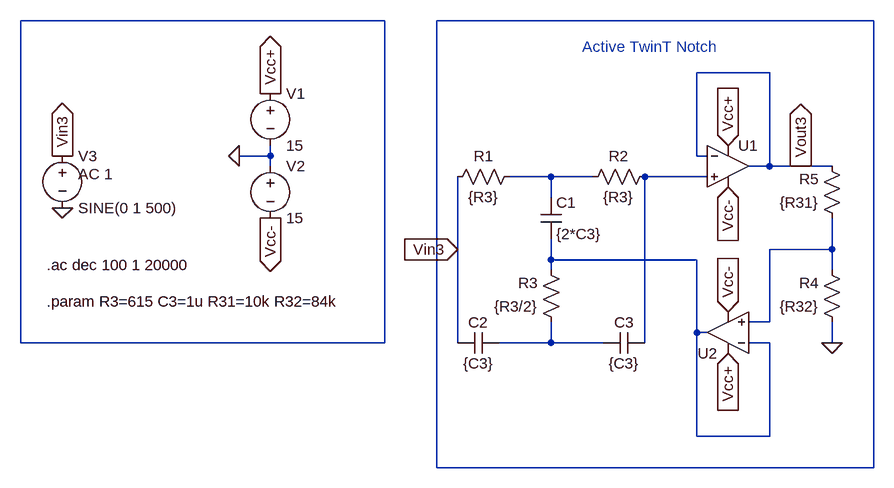
[diagram p0: schematic Twin_T_active.asc]
Twin_T_active.asc, the LTspice schematic file:
Version 4
SHEET 1 988 680
WIRE -128 -224 -688 -224
WIRE 624 -224 -48 -224
WIRE 464 -144 352 -144
WIRE -304 -16 -304 -32
WIRE -304 -16 -352 -16
WIRE 352 -16 352 -144
WIRE 368 -16 352 -16
WIRE -304 0 -304 -16
WIRE 464 0 464 -144
WIRE 464 0 432 0
WIRE 512 0 464 0
WIRE 560 0 512 0
WIRE 128 16 64 16
WIRE 192 16 128 16
WIRE 368 16 272 16
WIRE 128 48 128 16
WIRE -16 128 -16 16
WIRE 560 128 560 80
WIRE 560 128 464 128
WIRE 128 144 128 112
WIRE 352 144 128 144
WIRE 128 160 128 144
WIRE 560 160 560 128
WIRE 464 240 464 128
WIRE 464 240 432 240
WIRE 352 256 352 144
WIRE 368 256 352 256
WIRE -688 272 -688 -224
WIRE -128 272 -128 -224
WIRE -128 272 -688 272
WIRE -16 272 -16 128
WIRE 128 272 128 240
WIRE 128 272 48 272
WIRE 208 272 128 272
WIRE 272 272 272 16
WIRE 464 272 432 272
WIRE 560 272 560 240
WIRE 352 416 352 256
WIRE 464 416 464 272
WIRE 464 416 352 416
WIRE -48 464 -48 -224
WIRE 624 464 624 -224
WIRE 624 464 -48 464
FLAG 560 272 0
FLAG -304 -112 Vcc+
IOPIN -304 -112 Out
FLAG -304 80 Vcc-
IOPIN -304 80 Out
FLAG -352 -16 0
FLAG 400 288 Vcc+
IOPIN 400 288 In
FLAG 400 -32 Vcc+
IOPIN 400 -32 In
FLAG 400 32 Vcc-
IOPIN 400 32 In
FLAG 400 224 Vcc-
IOPIN 400 224 In
FLAG -624 64 0
FLAG -624 -16 Vin3
IOPIN -624 -16 Out
FLAG -16 128 Vin3
IOPIN -16 128 In
FLAG 512 0 Vout3
IOPIN 512 0 Out
SYMBOL res 80 0 R90
WINDOW 0 0 56 VBottom 2
WINDOW 3 32 56 VTop 2
SYMATTR InstName R1
SYMATTR Value {R3}
SYMBOL res 288 0 R90
WINDOW 0 0 56 VBottom 2
WINDOW 3 32 56 VTop 2
SYMATTR InstName R2
SYMATTR Value {R3}
SYMBOL res 144 256 R180
WINDOW 0 36 76 Left 2
WINDOW 3 36 40 Left 2
SYMATTR InstName R3
SYMATTR Value {R3/2}
SYMBOL res 576 256 R180
WINDOW 0 36 76 Left 2
WINDOW 3 36 40 Left 2
SYMATTR InstName R4
SYMATTR Value {R32}
SYMBOL res 576 96 R180
WINDOW 0 36 76 Left 2
WINDOW 3 36 40 Left 2
SYMATTR InstName R5
SYMATTR Value {R31}
SYMBOL cap 112 48 R0
SYMATTR InstName C1
SYMATTR Value {2*C3}
SYMBOL cap 48 256 R90
WINDOW 0 0 32 VBottom 2
WINDOW 3 32 32 VTop 2
SYMATTR InstName C2
SYMATTR Value {C3}
SYMBOL cap 272 256 R90
WINDOW 0 0 32 VBottom 2
WINDOW 3 32 32 VTop 2
SYMATTR InstName C3
SYMATTR Value {C3}
SYMBOL OpAmps\\UniversalOpAmp 400 0 R0
SYMATTR InstName U1
SYMBOL OpAmps\\UniversalOpAmp 400 256 R180
SYMATTR InstName U2
SYMBOL voltage -304 -128 R0
WINDOW 123 0 0 Left 0
WINDOW 39 0 0 Left 0
SYMATTR InstName V1
SYMATTR Value 15
SYMBOL voltage -304 -16 R0
WINDOW 123 0 0 Left 0
WINDOW 39 0 0 Left 0
SYMATTR InstName V2
SYMATTR Value 15
SYMBOL voltage -624 -32 R0
WINDOW 123 24 44 Left 2
WINDOW 39 0 0 Left 0
SYMATTR Value2 AC 1
SYMATTR InstName V3
SYMATTR Value SINE(0 1 500)
TEXT -648 208 Left 2 !.param R3=615 C3=1u R31=10k R32=84k
TEXT 176 -184 Left 2 ;Active TwinT Notch
TEXT -648 152 Left 2 !.ac dec 100 1 20000

The netlist it stands for:
* Twin_T_active.asc
R1 N003 Vin3 {R3}
R2 N004 N003 {R3}
R3 N007 N006 {R3/2}
R4 0 N005 {R32}
R5 N005 Vout3 {R31}
C1 N003 N006 {2*C3}
C2 N007 Vin3 {C3}
C3 N004 N007 {C3}
XU1 N004 Vout3 Vcc+ Vcc- Vout3 level1 Avol=1Meg GBW=10Meg Vos=0 En=0 Enk=0 In=0 Ink=0 Rin=500Meg  ; pins In+ In- V+ V- OUT
XU2 N005 N006 Vcc+ Vcc- N006 level1 Avol=1Meg GBW=10Meg Vos=0 En=0 Enk=0 In=0 Ink=0 Rin=500Meg  ; pins In+ In- V+ V- OUT
V1 Vcc+ 0 15
V2 0 Vcc- 15
V3 Vin3 0 SINE(0 1 500) AC 1
.param R3=615 C3=1u R31=10k R32=84k
* Active TwinT Notch
.ac dec 100 1 20000
.lib UniversalOpAmp1.lib
.backanno
.end